# Altium schematic sheet Microcontroller.SchDoc
size A; SheetNumber: 2; SheetTotal: 2
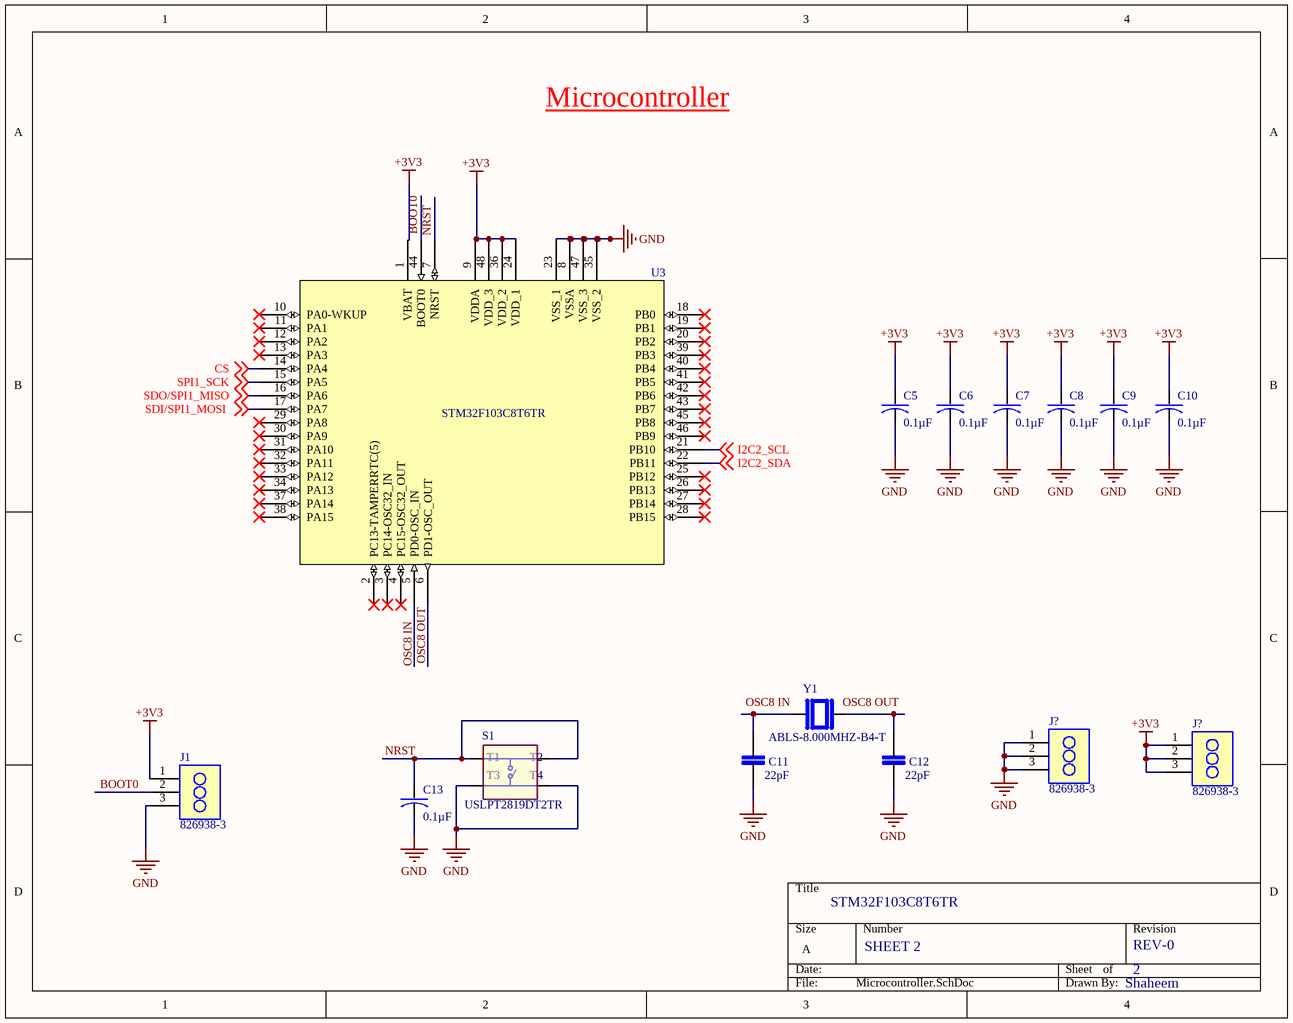
[diagram p0: Microcontroller.SchDoc]

## Parts
(Parts that share a designator on the sheet are numbered #1, #2 ... from top to bottom, then left to right.)
C5  0.1µF  [GRM155R71H104KE14-0.1uf ceramic capacitor]
C6  0.1µF  [GRM155R71H104KE14-0.1uf ceramic capacitor]
C7  0.1µF  [GRM155R71H104KE14-0.1uf ceramic capacitor]
C8  0.1µF  [GRM155R71H104KE14-0.1uf ceramic capacitor]
C9  0.1µF  [GRM155R71H104KE14-0.1uf ceramic capacitor]
C10  0.1µF  [GRM155R71H104KE14-0.1uf ceramic capacitor]
C11  22pF  [CAPC1608X90]
C12  22pF  [CAPC1608X90]
C13  0.1µF  [GRM155R71H104KE14-0.1uf ceramic capacitor]
J1  826938-3  [TE_826938-3]
J?#1  826938-3  [TE_826938-3]
J?#2  826938-3  [TE_826938-3]
S1  USLPT2819DT2TR  [SW_USLPT2819DT2TR]
U3  STM32F103C8T6TR
Y1  ABLS-8.000MHZ-B4-T  [XTAL_ABLS-8.000MHZ-B4-T]

## Nets
+3V3: C5.2 C6.2 C7.2 C8.2 C9.2 C10.2 J1.1 J?#2.1 J?#2.2 J?#2.3 U3.1(VBAT) U3.9(VDDA) U3.24(VDD_1) U3.36(VDD_2) U3.48(VDD_3)
GND: C5.1 C6.1 C7.1 C8.1 C9.1 C10.1 C11.1 C12.1 C13.1 J1.3 J?#1.1 J?#1.2 J?#1.3 S1.3(T3) S1.4(T4) U3.8(VSSA) U3.23(VSS_1) U3.35(VSS_2) U3.47(VSS_3)
BOOT0: J1.2 U3.44(BOOT0)
CS: U3.14(PA4) ; off-sheet CS
I2C2_SCL: U3.21(PB10) ; off-sheet I2C2_SCL
I2C2_SDA: U3.22(PB11) ; off-sheet I2C2_SDA
NRST: C13.2 S1.1(T1) S1.2(T2) U3.7(NRST)
SDI/SPI1_MOSI : U3.17(PA7) ; off-sheet SDI/SPI1_MOSI 
SDO/SPI1_MISO: U3.16(PA6) ; off-sheet SDO/SPI1_MISO
SPI1_SCK: U3.15(PA5) ; off-sheet SPI1_SCK
NetC11_2: C11.2 Y1.1
NetC12_2: C12.2 Y1.2

Not connected (* = marked no-connect by the designer): U3 2(PC13-TAMPERRTC(5))* 3(PC14-OSC32_IN)* 4(PC15-OSC32_OUT)* 5(PD0-OSC_IN) 6(PD1-OSC_OUT) 10(PA0-WKUP)* 11(PA1)* 12(PA2)* 13(PA3)* 18(PB0)* 19(PB1)* 20(PB2)* 25(PB12)* 26(PB13)* 27(PB14)* 28(PB15)* 29(PA8)* 30(PA9)* 31(PA10)* 32(PA11)* 33(PA12)* 34(PA13)* 37(PA14)* 38(PA15)* 39(PB3)* 40(PB4)* 41(PB5)* 42(PB6)* 43(PB7)* 45(PB8)* 46(PB9)*

## Notes on the sheet
- Microcontroller
- STM32F103C8T6TR
- SHEET 2
- REV-0
- 2
- Shaheem
- Labels drawn without touching a wire or pin: OSC8 IN, OSC8 OUT

## Library data of the parts
C5-C10 C13 = GRM155R71E104KE14J- 0.1 µF: 0402 0.1 uF 25 V ±10% Tolerance X7R SMT Multilayer Ceramic Capacitor; Manufacturer: Murata; Manufacturer Lifecycle Status: IN PRODUCTION; Value: 100nF; Voltage Rating: 25V; Supplier: DigiKey; Supplier Part Number: 490-14603-2-ND; Manufacturer Part Number: GRM155R71E104KE14J; RoHS: Compliant; Category: Ceramic Capacitors; Stock: 1424920; Pricing: 50000=0.00435, 100000=0.00402, 150000=0.00386, 250000=0.00368, 350000=0.00357, 500000=0.00347 (USD); Case/Package: 0402; Case Code (Imperial): 0402; Case Code (Metric): 1005; Composition: Ceramic; Dielectric: X7R; Dielectric Material: Ceramic; Height: 500µm; Length: 1mm; Lifecycle Status: Production; Material: Ceramic; Max Operating Temperature: 125°C; Min Operating Temperature: -55°C; Mounting Technology: Surface Mount; Pins: 2; Number of Terminals: 2; Packaging: Tape & Reel (TR); REACH SVHC: Yes; Schedule B: 8532240020, 8532240020|8532240020, 8532240020|8532240020|8532240020, 8532240020|8532240020|8532240020|8532240020; Termination: SMD/SMT; Thickness: 500µm; Tolerance: 10%; Voltage Rating (DC): 25V; Weight: 6.010099mg; Width: 500µm; ComponentLink1URL: https://datasheet.octopart.com:443/GRM155R71E104KE14J-Murata-datasheet-155345056.pdf?src-supplier=Newark; ComponentLink1Description: https://datasheet.octopart.com:443/GRM155R71E104KE14J-Murata-datasheet-155345056.pdf?src-supplier=Newark; ComponentLink2URL: https://datasheet.octopart.com:443/GRM155R71E104KE14J-Murata-datasheet-165579666.pdf?src-supplier=TME; ComponentLink2Description: https://datasheet.octopart.com:443/GRM155R71E104KE14J-Murata-datasheet-165579666.pdf?src-supplier=TME; ComponentLink3URL: https://datasheet.octopart.com:443/GRM155R71E104KE14J-Murata-datasheet-141266224.pdf?src-supplier=Ciiva; ComponentLink3Description: https://datasheet.octopart.com:443/GRM155R71E104KE14J-Murata-datasheet-141266224.pdf?src-supplier=Ciiva; ComponentLink4URL: https://datasheet.octopart.com:443/GRM155R71E104KE14J-Murata-datasheet-140691366.pdf?src-supplier=Ciiva; ComponentLink4Description: https://datasheet.octopart.com:443/GRM155R71E104KE14J-Murata-datasheet-140691366.pdf?src-supplier=Ciiva; ComponentLink5URL: https://datasheet.octopart.com:443/GRM155R71E104KE14J-Murata-datasheet-138740936.pdf?src-supplier=Ciiva; ComponentLink5Description: https://datasheet.octopart.com:443/GRM155R71E104KE14J-Murata-datasheet-138740936.pdf?src-supplier=Ciiva; ComponentLink6URL: https://datasheet.octopart.com/GRM155R71E104KE14J-Murata-datasheet-12515295.pdf; ComponentLink6Description: https://datasheet.octopart.com/GRM155R71E104KE14J-Murata-datasheet-12515295.pdf; ComponentLink7URL: https://datasheet.octopart.com/GRM155R71E104KE14J-Murata-datasheet-12510076.pdf; ComponentLink7Description: https://datasheet.octopart.com/GRM155R71E104KE14J-Murata-datasheet-12510076.pdf; ComponentLink8URL: https://datasheet.octopart.com/GRM155R71E104KE14J-Murata-datasheet-11978611.pdf; ComponentLink8Description: https://datasheet.octopart.com/GRM155R71E104KE14J-Murata-datasheet-11978611.pdf; ComponentLink9URL: https://datasheet.octopart.com/GRM155R71E104KE14J-Murata-datasheet-10025737.pdf; ComponentLink9Description: https://datasheet.octopart.com/GRM155R71E104KE14J-Murata-datasheet-10025737.pdf; ComponentLink10URL: https://datasheet.octopart.com/GRM155R71E104KE14J-Murata-datasheet-8819587.pdf; ComponentLink10Description: https://datasheet.octopart.com/GRM155R71E104KE14J-Murata-datasheet-8819587.pdf; ComponentLink11URL: https://datasheet.octopart.com/GRM155R71E104KE14J-Murata-datasheet-15634843.pdf; ComponentLink11Description: https://datasheet.octopart.com/GRM155R71E104KE14J-Murata-datasheet-15634843.pdf; ComponentLink12URL: https://datasheet.octopart.com:443/GRM155R71E104KE14J-Murata-datasheet-144363483.pdf?src-supplier=Arrow.cn; ComponentLink12Description: https://datasheet.octopart.com:443/GRM155R71E104KE14J-Murata-datasheet-144363483.pdf?src-supplier=Arrow.cn; ComponentLink13URL: http://sigma.octopart.com:80/reach_statement/Murata-company-16.pdf?src-supplier=Compliance+Statements; ComponentLink13Description: http://sigma.octopart.com:80/reach_statement/Murata-company-16.pdf?src-supplier=Compliance+Statements; Supplier 1: DigiKey; Supplier Part Number 1: 490-14603-1-ND
C11 C12 = C0603C220J5GACTU: 22pF Â±5% 50V Ceramic Capacitor C0G, NP0 0603 (1608 Metric); MF: KEMET; Value: *; Check_prices: https://www.snapeda.com/parts/C0603C220J5GACTU/KEMET/view-part/47101/?ref=eda; Price: None; MP: C0603C220J5GACTU; SnapEDA_Link: https://www.snapeda.com/parts/C0603C220J5GACTU/KEMET/view-part/47101/?ref=snap; Purchase-URL: https://pricing.snapeda.com/search/part/C0603C220J5GACTU/?ref=eda; Package: 0603 Kemet; Availability: Good
J?#1 J?#2 = 826938-3: Board Connector, 3 Contact(s), 1 Row(s), Male, Straight, Solder Terminal; Manufacturer: TE Connectivity; Manufacturer Lifecycle Status: ACTIVE; Connector Type: Header, Pin, Plug; Contact Current Rating: 5A; Contact Style: Pin; High Speed Serial Data Connector: No; Insulation Resistance: 5GΩ; Lead Length: 3.19786mm; Mating Post Length: 8.001mm; Number of Contacts: 3; Number of Ports: 1; PCB Mounting Orientation: Vertical; Pitch: 2.54mm; Plating Thickness: 2.999994µm; Shielding: Unshielded; Package: None; Price: None; Value: *; MP: 826938-3; Availability: Unavailable; Supplier: DigiKey; Supplier Part Number: 826938-3-ND; Manufacturer Part Number: 826938-3; RoHS: Compliant; Category: Card Edge Connectors; Pricing: 10500=0.46297 (USD); China RoHS: Compliant; Color: Green; Contact Material: Brass; Contact Mating Length: 8.001mm; Contact Plating: Tin; Contact Shape: Square; Current Rating: 5A; Export Control Classification Number (ECCN) Code: EAR99; ELV: Compliant; Flammability Rating: UL94 V-0; Gender: Male; High Temperature Housing: No; Housing Color: Green; Housing Material: PBT; Harmonized Tariff Schedule (HTS) Code: 8536.69.40.40; Introduction Date: 2022-01-04; Keyed: No; Lifecycle Status: Production; LTB Date: 2011-05-23; LTD Date: 2011-05-24; Max Operating Temperature: 105°C; Min Operating Temperature: -65°C; Mounting Technology: Through Hole; Pins: 3; Number of Positions: 3; Number of Rows: 1; Orientation: Vertical; Packaging: Box; REACH SVHC: Yes; Row Spacing: 2.54mm; Terminal Pitch: 2.54mm; Termination: Solder; ComponentLink1URL: https://datasheet.octopart.com:443/826938-3-TE-Connectivity-datasheet-180184162.pdf?src-supplier=Electro+Sonic; ComponentLink1Description: https://datasheet.octopart.com:443/826938-3-TE-Connectivity-datasheet-180184162.pdf?src-supplier=Electro+Sonic; ComponentLink2URL: https://datasheet.octopart.com:443/826938-3-TE-Connectivity-datasheet-180184161.pdf?src-supplier=Electro+Sonic; ComponentLink2Description: https://datasheet.octopart.com:443/826938-3-TE-Connectivity-datasheet-180184161.pdf?src-supplier=Electro+Sonic; ComponentLink3URL: https://datasheet.octopart.com:443/826938-3-TE-Connectivity---AMP-datasheet-111037972.pdf?src-supplier=IHS; ComponentLink3Description: https://datasheet.octopart.com:443/826938-3-TE-Connectivity---AMP-datasheet-111037972.pdf?src-supplier=IHS; ComponentLink4URL: https://sigma.octopart.com:443/136672967/technical_drawing/TE-Connectivity-826938-3.pdf?src-supplier=ShanghaiCT; ComponentLink4Description: https://sigma.octopart.com:443/136672967/technical_drawing/TE-Connectivity-826938-3.pdf?src-supplier=ShanghaiCT; ComponentLink5URL: https://sigma.octopart.com:443/32593528/technical_drawing/TE-Connectivity-826938-3.pdf?src-supplier=TE+Connectivity; ComponentLink5Description: https://sigma.octopart.com:443/32593528/technical_drawing/TE-Connectivity-826938-3.pdf?src-supplier=TE+Connectivity; ComponentLink6URL: https://datasheet.octopart.com:443/826938-3-TE-Connectivity-datasheet-181566106.pdf?src-supplier=Sager+Electronics; ComponentLink6Description: https://datasheet.octopart.com:443/826938-3-TE-Connectivity-datasheet-181566106.pdf?src-supplier=Sager+Electronics; ComponentLink7URL: https://datasheet.octopart.com:443/826938-3-TE-Connectivity-datasheet-145424376.pdf?src-supplier=RS+(Formerly+Allied+Electronics); ComponentLink7Description: https://datasheet.octopart.com:443/826938-3-TE-Connectivity-datasheet-145424376.pdf?src-supplier=RS+(Formerly+Allied+Electronics); Supplier 1: DigiKey; Supplier Part Number 1: 826938-3-ND
S1 = USLPT2819DT2TR: TACT ULTRA TB 2.8X1.9X0.6 160GF; Package: None; MP: USLPT2819DT2TR; Value: *; Availability: Unavailable; Price: None
U3 = STM32F103C8T6TR: MCU 32-bit STM32F1 ARM Cortex M3 RISC 64KB Flash 2.5V/3.3V 48-Pin LQFP T/R; Manufacturer: STMicroelectronics; ADC Channels (Resolution): 10-Ch 12-Bit; Data Bus Width: 32b; EEPROM Memory Size: 0B; Frequency: 72MHz; Interface: CAN, IrDA, LIN, USB; Clock Frequency: 1.25MHz; Max Power Dissipation: 363mW; Max Supply Current: 50mA; Max Supply Voltage: 3.6V; Min Supply Voltage: 2V; Nominal Supply Current: 1.7µA; Number of A/D Converters: 2; Number of ADC Channels: 10; Number of I/Os: 37; Number of Timers/Counters: 4; Number of USART Channels: 3; Operating Supply Voltage: 3.3V; Oscillator Type: Internal; Peripherals: POR; RAM Size: 20kB; Watchdog Timer: Yes; Supplier: DigiKey; Supplier Part Number: 497-17666-1-ND; Manufacturer Part Number: STM32F103C8T6TR; RoHS: Compliant; Category: Microcontrollers; Stock: 4099; Pricing: 1=6.15, 10=4.713, 25=4.3536, 100=3.9587, 250=3.77388 (USD); Case/Package: LFQFP; China RoHS: Compliant; Contact Plating: Gold; Core Architecture: ARM; Flash Memory Size: 64kB; Height - Seated (Max): 1.6mm; Lead Free: Lead Free; Length: 7mm; Lifecycle Status: Production; Max Operating Temperature: 85°C; Memory Size: 64kB; Memory Format: FLASH; Min Operating Temperature: -40°C; Number of Channels: 10; Number of I2C Channels: 2; Pins: 48; Number of Programmable I/O: 37; Number of SPI Channels: 2; Number of Terminals: 48; Packaging: Tape and Reel; Radiation Hardening: No; REACH SVHC: Yes; Schedule B: 8542310000, 8542310000|8542310000|8542310000|8542310000|8542310000; Temperature Grade: Industrial; Terminal Pitch: 500µm; Width: 7mm; ComponentLink1URL: https://datasheet.octopart.com:443/STM32F103C8T6TR-STMicroelectronics-datasheet-177520228.pdf?src-supplier=IHS; ComponentLink1Description: https://datasheet.octopart.com:443/STM32F103C8T6TR-STMicroelectronics-datasheet-177520228.pdf?src-supplier=IHS; ComponentLink2URL: https://datasheet.octopart.com:443/STM32F103C8T6TR-STMicroelectronics-datasheet-48026265.pdf?src-supplier=STMicroelectronics+SCT; ComponentLink2Description: https://datasheet.octopart.com:443/STM32F103C8T6TR-STMicroelectronics-datasheet-48026265.pdf?src-supplier=STMicroelectronics+SCT; ComponentLink3URL: https://datasheet.octopart.com:443/STM32F103C8T6TR-STMicroelectronics-datasheet-14363502.pdf?src-supplier=Upverter; ComponentLink3Description: https://datasheet.octopart.com:443/STM32F103C8T6TR-STMicroelectronics-datasheet-14363502.pdf?src-supplier=Upverter; ComponentLink4URL: https://datasheet.octopart.com:443/STM32F103C8T6TR-STMicroelectronics-datasheet-10330614.pdf?src-supplier=STMicroelectronics; ComponentLink4Description: https://datasheet.octopart.com:443/STM32F103C8T6TR-STMicroelectronics-datasheet-10330614.pdf?src-supplier=STMicroelectronics; ComponentLink5URL: https://datasheet.octopart.com:443/STM32F103C8T6TR-STMicroelectronics-datasheet-500013.pdf?src-supplier=STMicroelectronics; ComponentLink5Description: https://datasheet.octopart.com:443/STM32F103C8T6TR-STMicroelectronics-datasheet-500013.pdf?src-supplier=STMicroelectronics; ComponentLink6URL: https://datasheet.octopart.com:443/STM32F103C8T6TR-STMicroelectronics-datasheet-14106724.pdf?src-supplier=iiiC; ComponentLink6Description: https://datasheet.octopart.com:443/STM32F103C8T6TR-STMicroelectronics-datasheet-14106724.pdf?src-supplier=iiiC; ComponentLink7URL: https://datasheet.octopart.com:443/STM32F103C8T6TR-STMicroelectronics-datasheet-17594274.pdf?src-supplier=TME; ComponentLink7Description: https://datasheet.octopart.com:443/STM32F103C8T6TR-STMicroelectronics-datasheet-17594274.pdf?src-supplier=TME; ComponentLink8URL: https://datasheet.octopart.com:443/STM32F103C8T6TR-STMicroelectronics-datasheet-6396519.pdf?src-supplier=SHENGYU+ELECTRONICS; ComponentLink8Description: https://datasheet.octopart.com:443/STM32F103C8T6TR-STMicroelectronics-datasheet-6396519.pdf?src-supplier=SHENGYU+ELECTRONICS
Y1 = ABLS-8.000MHZ-B4-T: HC/49US (AT49) SMD LOW PROFILE CRYSTAL; MF: Abracon LLC; SnapEDA_Link: https://www.snapeda.com/parts/ABLS-8.000MHZ-B4-T/Abracon/view-part/?ref=snap; Package: HC-49/US Abracon LLC; Value: *; MP: ABLS-8.000MHZ-B4-T; Check_prices: https://www.snapeda.com/parts/ABLS-8.000MHZ-B4-T/Abracon/view-part/?ref=eda
J1 = 826938-3: Package: None; Price: None; Value: *; MP: 826938-3; Availability: Unavailable